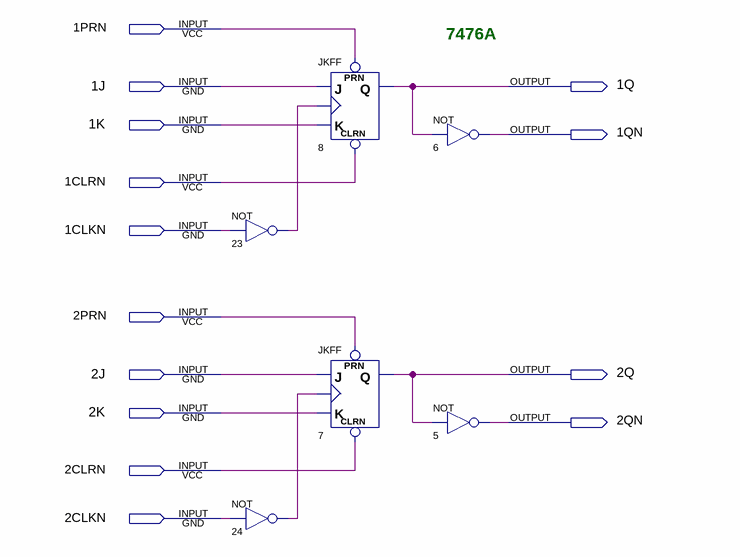
[diagram p0: schematic sheet]
// Quartus schematic 7476a.bdf as structural Verilog: 6 symbols, 14 pins
module \7476a  (
  input  \1PRN ,
  input  \1J ,
  input  \1K ,
  input  \1CLRN ,
  input  \1CLKN ,
  input  \2PRN ,
  input  \2J ,
  input  \2K ,
  input  \2CLRN ,
  input  \2CLKN ,
  output \1Q ,
  output \1QN ,
  output \2Q ,
  output \2QN 
);

  wire n23_out, n24_out;

  not u_23 (n23_out, \1CLKN );
  not u_24 (n24_out, \2CLKN );
  JKFF u_8 (.PRN(\1PRN ), .CLRN(\1CLRN ), .K(\1K ), .J(\1J ), .CLK(n23_out), .Q(\1Q ));
  JKFF u_7 (.PRN(\2PRN ), .CLRN(\2CLRN ), .K(\2K ), .J(\2J ), .CLK(n24_out), .Q(\2Q ));
  not u_6 (\1QN , \1Q );
  not u_5 (\2QN , \2Q );

  // Notes on the sheet:
  //   7476A
endmodule
